# EAGLE board 7_7_9_usb_fpga (EAGLE 5.06)
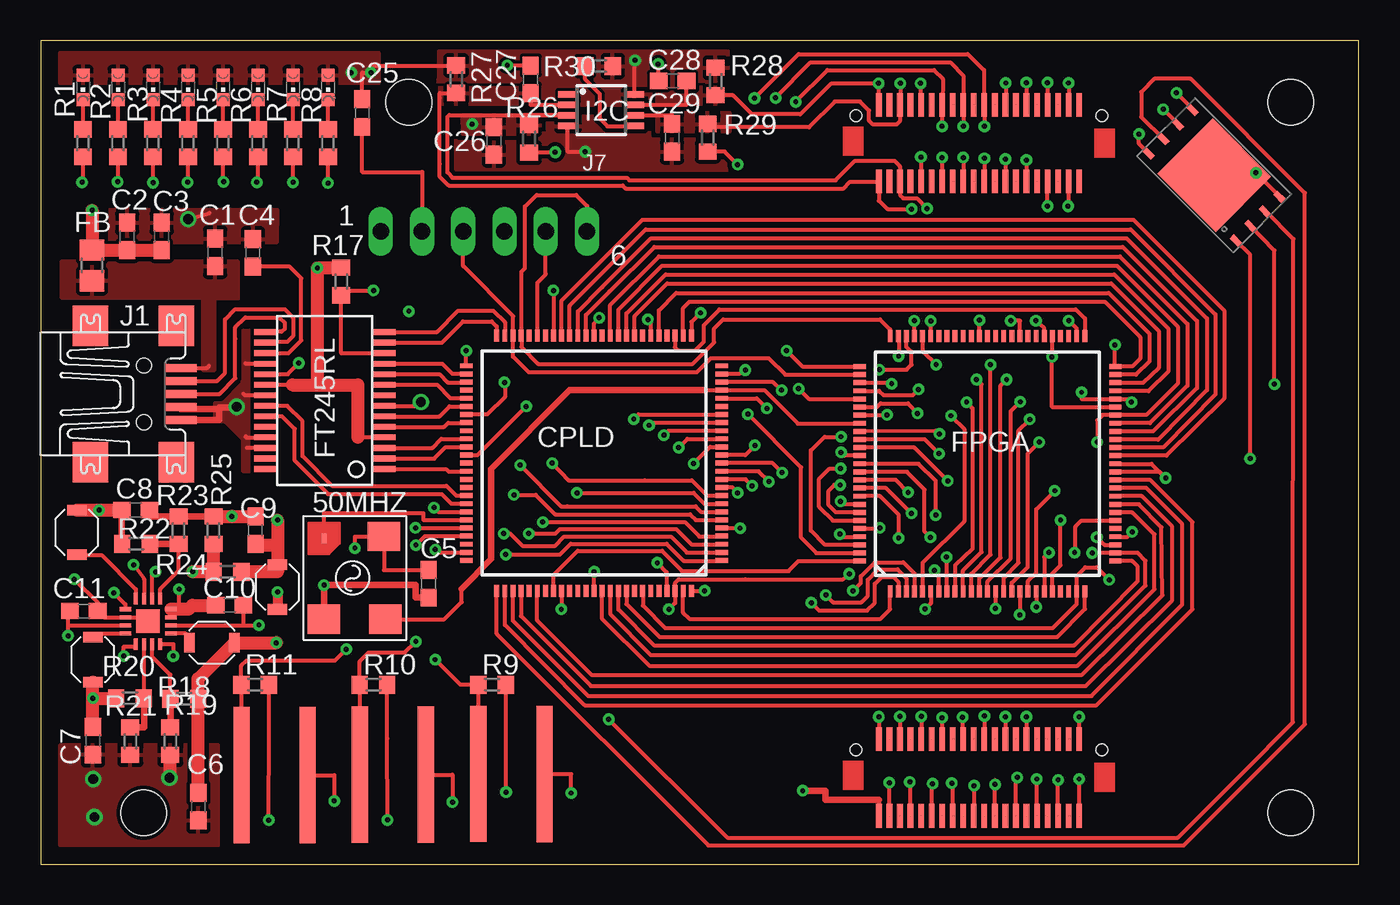
[diagram p2: board, top side]
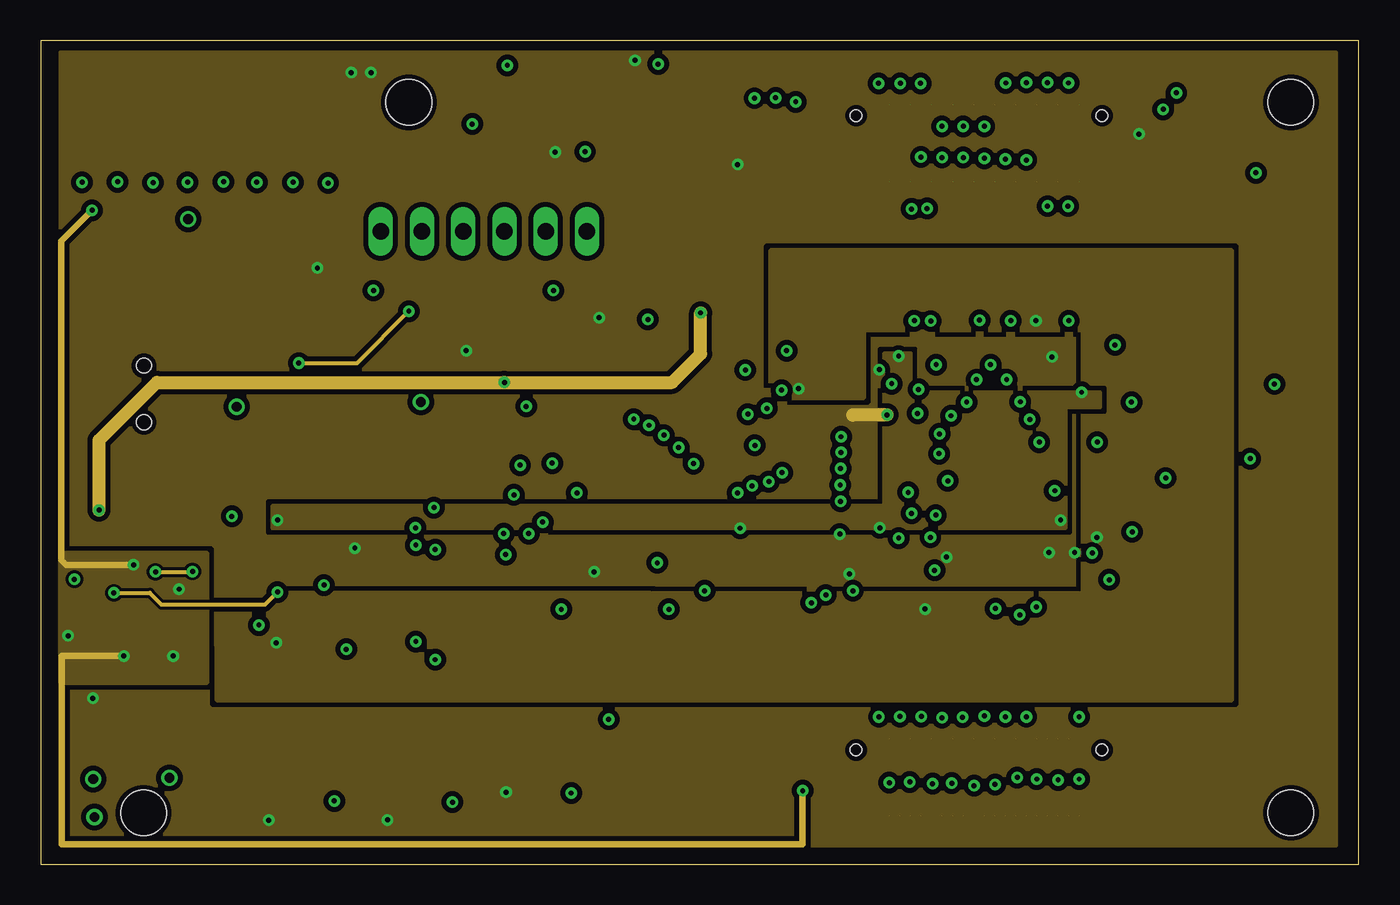
[diagram p3: board, inner layer Route2]
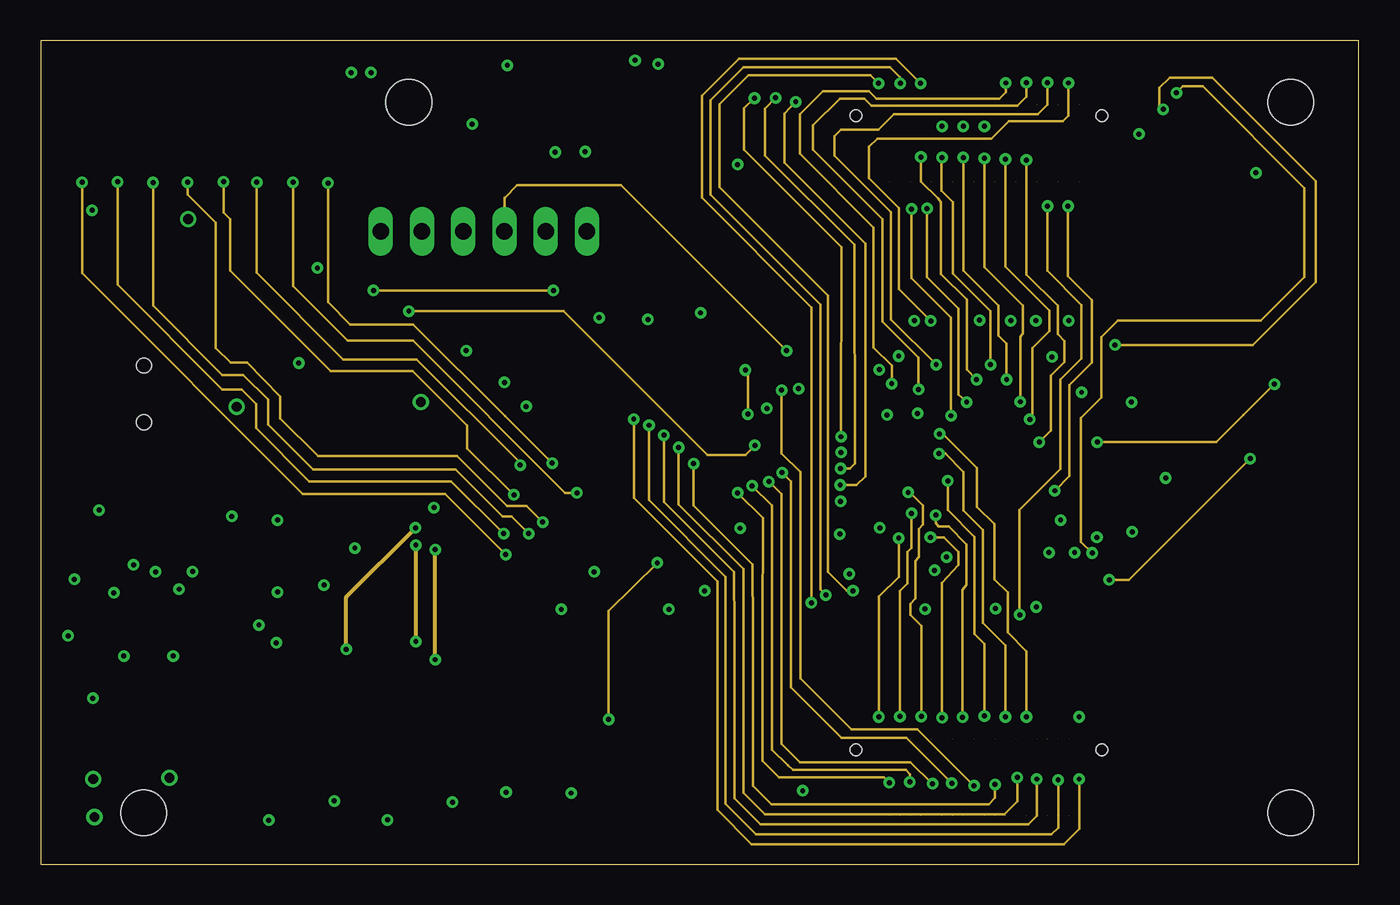
[diagram p4: board, inner layer Route15]
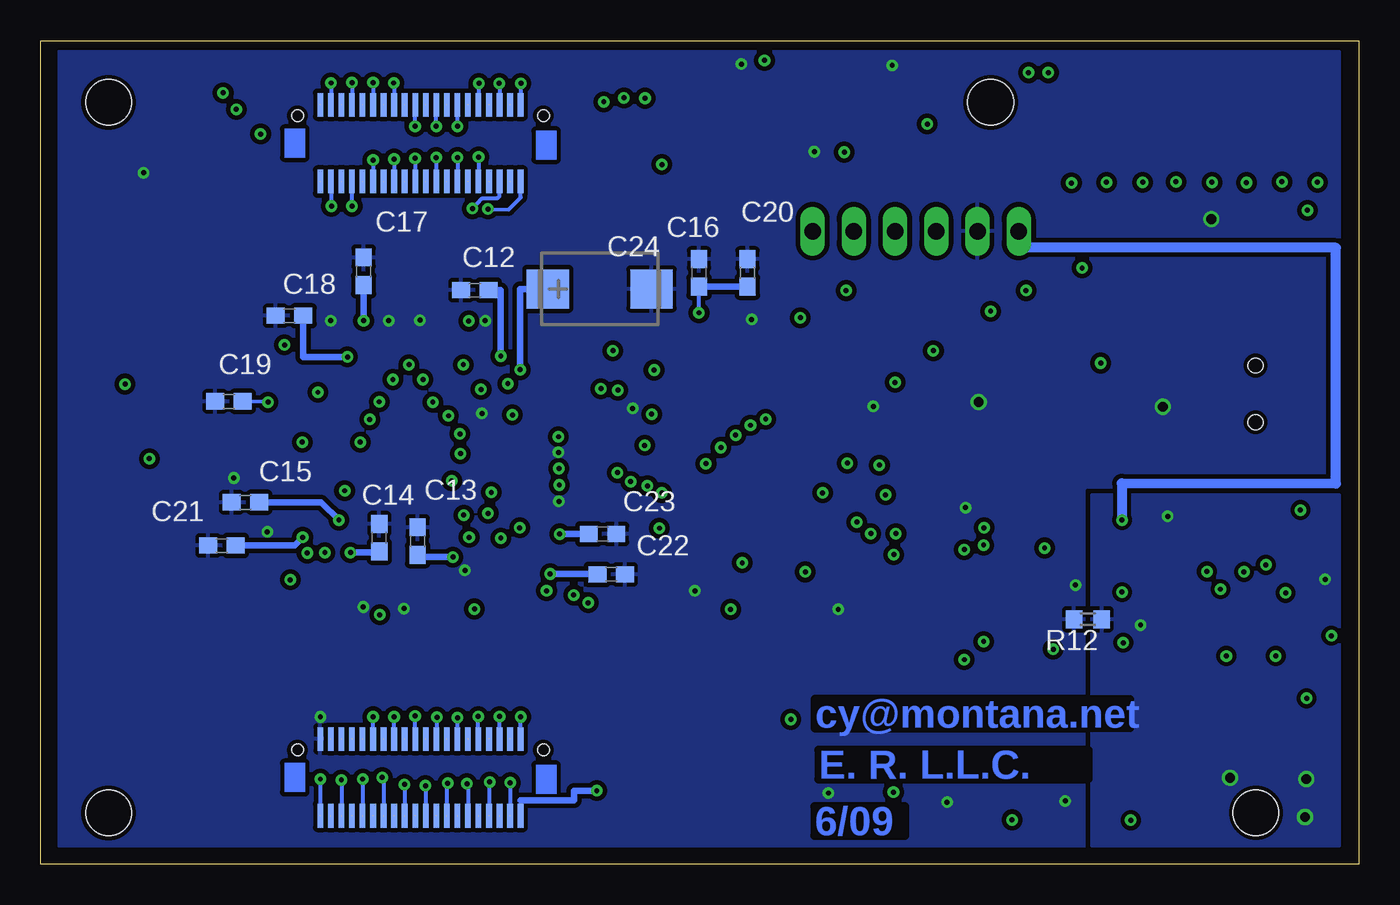
[diagram p5: board, bottom side, seen from below]

Size 81.29 x 50.8 mm. Coordinates in mm from the lower left corner, seen from the top.
Outline: 0,0 81.28,0 81.28,50.8 0,50.8 0,0
Copper layers (1*2+15*16): Top 0.055mm / dielectric 0.15mm / Route2 0.055mm / dielectric 0.15mm / Route15 0.055mm / dielectric 0.15mm / Bottom 0.055mm
Design rules "default *": minimum track width 5mil, minimum drill 12mil, track to track 7mil, track to pad 7mil, pad to pad 7mil, via to via 7mil, smd to smd 5mil, copper to edge 10mil, drill to drill 12mil, minimum pad ring 10mil, minimum via ring 8mil, stop-mask expansion 4mil, vias tented up to drill 0mil, thermal gap 10mil
Holes 2.8 mm at 77.09,46.99 77.09,3.17 22.71,46.99 6.35,3.17

## Footprints (pad centres in the part's own frame; a part is rotated, then mirrored left to right if it is on the bottom)
CB3 = smd 0.61 x 0.305: 1 -2.445,-1.905 | smd 1.803 x 2.007: 2 2.54,-1.905; 3 2.54,1.873; 4 -2.561,1.789
C0603 = smd 1.1 x 1: 1 -0.85,0; 2 0.85,0
CT7343 = smd 2.6 x 2.4: + -3.2,0; - 3.2,0
VQ100 = smd 0.75 x 0.3: 1 -7.875,6; 2 -7.875,5.5; 3 -7.875,5; 4 -7.875,4.5; 5 -7.875,4; 6 -7.875,3.5; 7 -7.875,3; 8 -7.875,2.5; 9 -7.875,2; 10 -7.875,1.5; 11 -7.875,1; 12 -7.875,0.5; 13 -7.875,0; 14 -7.875,-0.5; 15 -7.875,-1; 16 -7.875,-1.5; 17 -7.875,-2; 18 -7.875,-2.5; 19 -7.875,-3; 20 -7.875,-3.5; 21 -7.875,-4; 22 -7.875,-4.5; 23 -7.875,-5; 24 -7.875,-5.5; 25 -7.875,-6; 51 7.875,-6; 52 7.875,-5.5; 53 7.875,-5; 54 7.875,-4.5; 55 7.875,-4; 56 7.875,-3.5; 57 7.875,-3; 58 7.875,-2.5; 59 7.875,-2; 60 7.875,-1.5; 61 7.875,-1; 62 7.875,-0.5; 63 7.875,0; 64 7.875,0.5; 65 7.875,1; 66 7.875,1.5; 67 7.875,2; 68 7.875,2.5; 69 7.875,3; 70 7.875,3.5; 71 7.875,4; 72 7.875,4.5; 73 7.875,5; 74 7.875,5.5; 75 7.875,6 | smd 0.3 x 0.75: 26 -6,-7.875; 27 -5.5,-7.875; 28 -5,-7.875; 29 -4.5,-7.875; 30 -4,-7.875; 31 -3.5,-7.875; 32 -3,-7.875; 33 -2.5,-7.875; 34 -2,-7.875; 35 -1.5,-7.875; 36 -1,-7.875; 37 -0.5,-7.875; 38 0,-7.875; 39 0.5,-7.875; 40 1,-7.875; 41 1.5,-7.875; 42 2,-7.875; 43 2.5,-7.875; 44 3,-7.875; 45 3.5,-7.875; 46 4,-7.875; 47 4.5,-7.875; 48 5,-7.875; 49 5.5,-7.875; 50 6,-7.875; 76 6,7.875; 77 5.5,7.875; 78 5,7.875; 79 4.5,7.875; 80 4,7.875; 81 3.5,7.875; 82 3,7.875; 83 2.5,7.875; 84 2,7.875; 85 1.5,7.875; 86 1,7.875; 87 0.5,7.875; 88 0,7.875; 89 -0.5,7.875; 90 -1,7.875; 91 -1.5,7.875; 92 -2,7.875; 93 -2.5,7.875; 94 -3,7.875; 95 -3.5,7.875; 96 -4,7.875; 97 -4.5,7.875; 98 -5,7.875; 99 -5.5,7.875; 100 -6,7.875
R0805 = smd 1.3 x 1.5: 1 -0.95,0; 2 0.95,0
SSOP28DB = smd 0.348 x 1.397: 1 -4.225,-3.656; 2 -3.575,-3.656; 3 -2.925,-3.656; 4 -2.275,-3.656; 5 -1.625,-3.656; 6 -0.975,-3.656; 7 -0.325,-3.656; 8 0.325,-3.656; 9 0.975,-3.656; 10 1.625,-3.656; 11 2.275,-3.656; 12 2.925,-3.656; 13 3.575,-3.656; 14 4.225,-3.656; 15 4.225,3.656; 16 3.575,3.656; 17 2.925,3.656; 18 2.275,3.656; 19 1.625,3.656; 20 0.975,3.656; 21 0.325,3.656; 22 -0.325,3.656; 23 -0.975,3.656; 24 -1.625,3.656; 25 -2.275,3.656; 26 -2.925,3.656; 27 -3.575,3.656; 28 -4.225,3.656
MSOP8 = smd 0.4 x 1.2: 1 -0.975,-2.05; 2 -0.325,-2.05; 3 0.325,-2.05; 4 0.975,-2.05; 5 0.975,2.05; 6 0.325,2.05; 7 -0.325,2.05; 8 -0.975,2.05
UX60-MB-5ST = smd 2 x 0.5: 1 2.25,1.6; 2 2.25,0.8; 3 2.25,0; 4 2.25,-0.8; 5 2.25,-1.6 | smd 2.2 x 2.5: M1 -3.3,-4.2; M2 -3.3,4.2; M3 2,4.2; M4 2,-4.2 | hole 0.9: 0,-1.75; 0,1.75
DF15 = smd 1.45 x 0.35: P$1 -2.366,6.175; P$2 -2.366,5.525; P$3 -2.366,4.875; P$4 -2.366,4.225; P$5 -2.366,3.575; P$6 -2.366,2.925; P$7 -2.366,2.275; P$8 -2.366,1.625; P$9 -2.366,0.975; P$10 -2.366,0.325; P$11 -2.366,-0.325; P$12 -2.366,-0.975; P$13 -2.366,-1.625; P$14 -2.366,-2.275; P$15 -2.366,-2.925; P$16 -2.366,-3.575; P$17 -2.366,-4.225; P$18 -2.366,-4.875; P$19 -2.366,-5.525; P$20 -2.366,-6.175; P$21 2.366,-6.175; P$22 2.366,-5.525; P$23 2.366,-4.875; P$24 2.366,-4.225; P$25 2.366,-3.575; P$26 2.366,-2.925; P$27 2.366,-2.275; P$28 2.366,-1.625; P$29 2.366,-0.975; P$30 2.366,-0.325; P$31 2.366,0.325; P$32 2.366,0.975; P$33 2.366,1.625; P$34 2.366,2.275; P$35 2.366,2.925; P$36 2.366,3.575; P$37 2.366,4.225; P$38 2.366,4.875; P$39 2.366,5.525; P$40 2.366,6.175 | hole 0.7: 1.693,7.577; 1.69,-7.583
DF15_ = smd 1.45 x 0.35: P$1 -2.366,6.175; P$2 -2.366,5.525; P$3 -2.366,4.875; P$4 -2.366,4.225; P$5 -2.366,3.575; P$6 -2.366,2.925; P$7 -2.366,2.275; P$8 -2.366,1.625; P$9 -2.366,0.975; P$10 -2.366,0.325; P$11 -2.366,-0.325; P$12 -2.366,-0.975; P$13 -2.366,-1.625; P$14 -2.366,-2.275; P$15 -2.366,-2.925; P$16 -2.366,-3.575; P$17 -2.366,-4.225; P$18 -2.366,-4.875; P$19 -2.366,-5.525; P$20 -2.366,-6.175; P$21 2.366,-6.175; P$22 2.366,-5.525; P$23 2.366,-4.875; P$24 2.366,-4.225; P$25 2.366,-3.575; P$26 2.366,-2.925; P$27 2.366,-2.275; P$28 2.366,-1.625; P$29 2.366,-0.975; P$30 2.366,-0.325; P$31 2.366,0.325; P$32 2.366,0.975; P$33 2.366,1.625; P$34 2.366,2.275; P$35 2.366,2.925; P$36 2.366,3.575; P$37 2.366,4.225; P$38 2.366,4.875; P$39 2.366,5.525; P$40 2.366,6.175
6410-06 = drill 1.016 long: 1 6.35,0; 2 3.81,0; 3 1.27,0; 4 -1.27,0; 5 -3.81,0; 6 -6.35,0
L3010 = smd 0.65 x 1.2: P$1 -1.375,0; P$2 1.375,0
CHIPLED_0603 = smd 0.8 x 0.8: A 0,-0.75; C 0,0.75
R0603 = smd 1 x 1.1: 1 -0.85,0; 2 0.85,0
VDFPN8 = smd 0.762 x 0.356: 1 -3.81,1.905; 2 -3.81,0.635; 3 -3.81,-0.635; 4 -3.81,-1.905; 5 3.81,-1.905; 6 3.81,-0.635; 7 3.81,0.635; 8 3.81,1.905 | smd 5.08 x 4.826: NC 0,0
BS3N = smd 8.4 x 1: 1 -0.01,-2.035; 2 0,2.035
QFN16 = smd 0.7 x 0.25: 1 -1.4,0.75; 2 -1.4,0.25; 3 -1.4,-0.25; 4 -1.4,-0.75; 9 1.4,-0.75; 10 1.4,-0.25; 11 1.4,0.25; 12 1.4,0.75 | smd 0.25 x 0.7: 5 -0.75,-1.4; 6 -0.25,-1.4; 7 0.25,-1.4; 8 0.75,-1.4; 13 0.75,1.4; 14 0.25,1.4; 15 -0.25,1.4; 16 -0.75,1.4 | smd 1.45 x 1.45: P$17 0,0

## Placement (x,y rotation side)
50MHZ  CB3  [CB3]  19.38,17.65 270 top
C1  .01 UF  [C0603]  10.77,37.74 90 top
C2  4.7 UF  [C0603]  5.35,38.72 90 top
C3  .1 UF  [C0603]  7.47,38.72 90 top
C4  .1 UF  [C0603]  13.09,37.71 90 top
C5  .01 UF  [C0603]  23.93,17.3 90 top
C6  4.7 UF  [C0603]  9.73,3.56 270 top
C7  4.7 UF  [C0603]  3.23,7.62 270 top
C8  4.7 UF  [C0603]  5.87,21.84 0 top
C9  4.7 UF  [C0603]  13.26,20.6 90 top
C10  4.7 UF  [C0603]  11.66,15.98 0 top
C11  4.7 UF  [C0603]  2.67,15.62 180 top
C12  4.7 UF  [C0603]  54.51,35.41 180 bottom
C13  4.7 UF  [C0603]  58.04,19.94 90 bottom
C14  .47 UF  [C0603]  60.4,20.14 90 bottom
C15  .47 UF  [C0603]  68.66,22.33 180 bottom
C16  .47 UF  [C0603]  40.69,36.47 90 bottom
C17  .47 UF  [C0603]  61.37,36.58 90 bottom
C18  .047 UF  [C0603]  65.94,33.83 180 bottom
C19  .047 UF  [C0603]  69.67,28.55 180 bottom
C20  .047 UF  [C0603]  37.69,36.47 90 bottom
C21  .047 UF  [C0603]  70.1,19.66 180 bottom
C22  .047 UF  [C0603]  46.1,17.88 0 bottom
C23  .047 UF  [C0603]  46.63,20.37 0 bottom
C24  470 UF  [CT7343]  46.81,35.48 0 bottom
C25  50 PF  [C0603]  19.83,46.33 270 top
C26  50 PF  [C0603]  27.95,44.62 270 top
C27  50 PF  [C0603]  30.22,48.41 90 top
C28  50 PF  [C0603]  38.97,48.31 180 top
C29  50 PF  [C0603]  38.94,44.81 270 top
CPLD  XC2C64A_VQ100  [VQ100]  34.12,24.74 180 top
FB  1uH  [R0805]  3.17,36.93 90 top
FPGA  XC3S100E_VQ100  [VQ100]  58.38,24.7 90 top
FT245RL  FT245RL  [SSOP28DB]  17.53,28.6 90 top
I2C  LTC4300-1  [MSOP8]  34.57,46.51 270 top
J1  MINI-USB  [UX60-MB-5ST]  6.38,29.01 0 top
J3  DF15_40  [DF15]  57.86,5.36 90 top
J4  DF15_40_  [DF15_]  57.86,5.36 270 bottom
J5  DF15_40  [DF15]  57.86,44.48 90 top
J6  DF15_40_  [DF15_]  57.86,44.48 270 bottom
J7  22-27-2061-06  [6410-06]  27.33,39.04 180 top
L1  4.7 UH  [L3010]  10.57,13.67 0 top
L2  4.7 UH  [L3010]  14.61,17.09 270 top
L3  4.7 UH  [L3010]  2.24,20.47 270 top
L4  4.7 UH  [L3010]  3.23,12.62 270 top
LED1  [CHIPLED_0603]  2.62,47.9 180 top
LED2  [CHIPLED_0603]  4.78,47.9 180 top
LED3  [CHIPLED_0603]  6.93,47.9 180 top
LED4  [CHIPLED_0603]  9.09,47.9 180 top
LED5  [CHIPLED_0603]  11.25,47.9 180 top
LED6  [CHIPLED_0603]  13.41,47.9 180 top
LED7  [CHIPLED_0603]  15.57,47.9 180 top
LED8  [CHIPLED_0603]  17.73,47.9 180 top
R1  [R0603]  2.62,44.48 90 top
R2  [R0603]  4.78,44.48 90 top
R3  [R0603]  6.93,44.48 90 top
R4  [R0603]  9.09,44.48 90 top
R5  [R0603]  11.25,44.48 90 top
R6  [R0603]  13.41,44.48 90 top
R7  [R0603]  15.57,44.48 90 top
R8  [R0603]  17.73,44.48 90 top
R9  10k  [R0603]  27.84,11.07 0 top
R10  10k  [R0603]  20.52,11.07 0 top
R11  10k  [R0603]  13.23,11.07 0 top
R12  0  [R0603]  16.71,15.11 180 bottom
R17  10k  [R0603]  18.54,35.94 90 top
R18  500  [R0603]  8.86,10.21 0 top
R19  1k3  [R0603]  8,7.59 90 top
R20  3125  [R0603]  5.51,10.24 180 top
R21  1k3  [R0603]  5.54,7.59 90 top
R22  1250  [R0603]  5.89,19.76 180 top
R23  1k3  [R0603]  8.51,20.6 270 top
R24  2125  [R0603]  11.53,18.03 0 top
R25  1k3  [R0603]  10.67,20.6 270 top
R26  20 k  [R0603]  30.12,44.74 270 top
R27  20 k  [R0603]  25.62,48.41 90 top
R28  20 k  [R0603]  41.62,48.28 90 top
R29  20 k  [R0603]  41.14,44.81 270 top
R30  10 k  [R0603]  34.43,49.23 0 top
SPI_FLASH  M25P16  [VDFPN8]  72.36,42.5 135 top
SW1  BS3N  [BS3N]  29.03,5.57 270 top
SW2  BS3N  [BS3N]  21.72,5.53 270 top
SW3  BS3N  [BS3N]  14.43,5.5 270 top
VOLTAGE_REG  LTC3544  [QFN16]  6.63,14.99 270 top

## Tracks (layer width: path | path; a pad name or v marks a point on that pad's centre or on a via)
1.8V  (via drill 0.3, 0.3 pad 0.41)
  Top 0.254: CPLD.57 27.54,27.74 28.63,28.83 28.63,29.82 v28.6,29.72 | CPLD.26 40.12,33.45 v40.69,34.01
  Top 0.406: C8.1 5.02,19.76 R22.2
  Top 0.813: 5.02,19.76 R22.2 | 4.93,21.93 C8.1 v3.61,21.84 L3.P$1
  Route2 0.813: v40.69,34.01 40.69,31.47 38.94,29.72 v28.6,29.72 7.16,29.72 3.61,26.16 v3.61,21.84
  Bottom 0.254: v40.69,34.01 C16.1
  Bottom 0.406: C16.1 C20.1
_D1
  Top 0.254: FPGA.41 66.27,26.19 68.91,26.19 71.91,29.23 71.91,33.66 66.95,38.61 37.64,38.61 34.62,35.59 33.12,34.09 CPLD.40
_D2
  Top 0.254: FPGA.40 66.29,25.7 69.22,25.7 72.44,28.98 72.44,33.91 67.21,39.14 37.31,39.14 34.12,35.95 32.62,34.45 CPLD.41
_D3
  Top 0.254: CPLD.77 28.62,14.76 33.55,9.8 65.1,9.8 71.02,15.72 71.02,21.11 68.43,23.7 66.33,23.7 FPGA.36
_D4
  Top 0.254: CPLD.78 29.12,15.02 33.76,10.39 64.8,10.39 70.38,16.03 70.38,20.98 68.17,23.22 66.4,23.22 FPGA.35
_D5
  Top 0.254: CPLD.79 29.62,15.31 33.93,11 64.44,11 69.77,16.28 69.77,20.83 67.89,22.71 FPGA.34
_D6
  Top 0.254: CPLD.81 30.62,15.04 33.96,11.68 64.21,11.68 69.16,16.59 69.11,20.78 67.72,22.2 66.36,22.2 FPGA.33
_D7
  Top 0.254: CPLD.89 34.62,15.13 37.54,12.24 63.93,12.24 68.68,16.97 68.68,20.34 67.31,21.69 FPGA.32
AGND  (via drill 0.3, 0.6)
  Top 0.254: VOLTAGE_REG.14 11.35,14.74 12.55,14.74 | 12.55,14.74 13.44,14.74 v13.46,14.76 | C10.2 12.51,14.78 12.55,14.74 | v2.08,17.58 3.52,16.14 C11.1 3.9,15.24 VOLTAGE_REG.6 6.38,15.24 VOLTAGE_REG.P$17
  Top 0.406: C8.2 6.72,21.45 R23.1 R25.1
  Top 0.813: R25.1 11.77,21.45 v11.79,21.46 13.24,21.46 C9.2 | R19.1 7.95,6.62 v7.95,5.33
  other vias: 3.25,5.26 3.33,2.92
  pour Bottom (isolate 0.254): 1.22,1.17 1.22,22.76 16.46,22.76 16.46,1.17
  pour Top (isolate 0.254): 1.22,7.37 10.92,7.37 10.92,1.17 1.22,1.17
BUSY
  Top 0.254: CPLD.91 35.62,15.71 37.82,13.51 63.73,13.51 67.64,17.48 67.64,18.36 67.31,18.69 66.28,18.69 FPGA.26
CCLK  (via drill 0.3)
  Top 0.254: v66.24,32.03 66.24,30.71 FPGA.50 67.31,30.71 67.79,31.19 67.79,32.51 65.61,34.7 40.41,34.7 40.01,34.7 39.62,34.31 CPLD.27 | SPI_FLASH.6 69.98,45.79 v69.22,46.56
  Route15 0.152: v69.22,46.56 68.99,46.79 68.99,47.88 69.62,48.51 72.24,48.51 78.61,42.14 78.61,35.89 74.75,32.03 v66.24,32.03
CE
  Top 0.254: 50MHZ.1 17.48,21.67 23.6,21.67 23.6,21.24 CPLD.70
CSO_B  (via drill 0.3)
  Top 0.254: CPLD.94 37.13,16.86 37.13,15.95 38.51,14.58 62.41,14.58 63.88,16.05 FPGA.24 63.88,17.78 64.41,18.31 65.13,18.31 v65.89,17.55 | SPI_FLASH.1 74.57,37.59 v74.57,25.02
  Route15 0.152: v74.57,25.02 67.11,17.55 v65.89,17.55
D0
  Top 0.254: FT245RL.1 24.99,24.38 25.13,24.23 CPLD.64
D1
  Top 0.254: FT245RL.5 24.88,26.98 25.13,27.23 26.21,27.23 CPLD.58
D2
  Top 0.254: FT245RL.3 24.16,25.68 24.7,26.24 CPLD.60
D3
  Top 0.254: FT245RL.11 24.76,30.88 25.39,30.25 26.24,30.25 CPLD.52
D4
  Top 0.254: FT245RL.2 24.28,25.02 24.98,25.73 26.21,25.73 CPLD.61
D5
  Top 0.254: FT245RL.9 24.44,29.57 25.26,28.75 26.24,28.75 CPLD.55
D6
  Top 0.254: FT245RL.10 24.6,30.23 25.11,29.72 26.27,29.72 CPLD.53
D7
  Top 0.254: FT245RL.6 24.59,27.62 25.21,28.25 CPLD.56
DGND  (via drill 0.3, 0.3 pad 0.41, 0.6)
  Top 0.254: v9.11,39.79 10.41,40.16 | FT245RL.7 23.18,28.27 v23.44,28.51 | FT245RL.26 12.73,25.68 12.72,25.68 | FT245RL.21 12.6,28.93 12.52,29.01 | FT245RL.18 12.66,30.88 12.62,30.91 | FPGA.19 61.39,16.82 v61.39,15.88 | FPGA.14 v58.88,15.77 | FPGA.37 68.99,24.2 v69.37,23.82 68.49,24.7 FPGA.38 | FPGA.52 63.88,33.04 v63.4,33.53 | FPGA.64 v57.88,33.55 v57.89,33.55 | FPGA.72 53.88,33.52 v53.87,33.53 | FPGA.87 49.56,25.2 v49.35,25.4 | CPLD.21 44.16,28.74 v44.78,28.12 | CPLD.84 32.12,15.74 v32.11,15.72 | CPLD.100 41.07,16.86 v40.95,16.87 | CPLD.69 24.51,21.74 v24.26,22 | FPGA.29 67.01,20.2 v67.31,20.5 | CPLD.31 37.62,33.37 arc90 v37.44,33.6 | CPLD.62 26.94,25.24 v29.95,28.25 | FPGA.59 60.38,33.53 v59.82,33.53 | FPGA.7 55.38,17.85 v55.12,18.14 | SPI_FLASH.4 76.43,41.15 v74.93,42.65 | FPGA.81 51.57,28.2 51.79,28.42 53.49,28.42 v54.08,27.81 | FPGA.93 49.45,22.2 v49.33,22.38 | 32.51,45.55 32.51,43.95 v33.57,43.95 | FT245RL.25 12.65,26.32 12.65,26.39 | C28.2 38.08,48.31 v38.08,49.35 | C27.2 28.78,49.26 v28.78,49.28 | C25.2 19.83,42.7 23.55,42.7 23.52,42.7 J7.2 | SW3.2 18.11,5.5 v18.11,3.91 | SW2.2 25.4,5.53 v25.4,3.83 | SW1.2 32.72,5.57 v32.72,4.39 | J4.P$20 v64.03,9.09
  Top 0.406: 50MHZ.2 v17.48,17.22 23.11,17.22 23.11,16.46 C5.1 | J1.5 11.02,27.41 11.02,28.09 | 11.02,28.09 11.02,28.17 12.09,28.17 v12.09,28.22 | J1.4 8.62,28.09 11.02,28.09
  Top 0.813: C5.1
  pour Bottom (isolate 0.279, rank 2): 1.22,1.17 1.22,50.09 80.14,50.09 80.14,1.17
  pour Top: 4.32,40.37 14.58,40.37 14.55,38.35 4.29,38.35
  pour Top (isolate 0.254): 10.77,28.45 11.25,28.45 12.47,29.67 12.47,31.24 12.5,32.92 12.88,32.92 12.9,24.23 12.5,24.23 12.5,26.19 11.38,27.3 10.77,27.3
  pour Top (isolate 0.254, rank 2): 24.83,46.17 42.54,46.14 42.54,42.79 24.84,42.8 24.83,43.18 24.84,45.22
DIN/_D0  (via drill 0.3)
  Top 0.254: CPLD.35 35.62,34.2 38.33,36.91 66.37,36.91 70.1,33.17 70.1,29.64 68.17,27.71 FPGA.44 66.25,27.71 65.48,27.71 65.15,27.38 v65.15,26.04 | SPI_FLASH.2 76.07,37.86 v76.07,29.62
  Route15 0.152: v76.07,29.62 74.17,27.71 72.49,26.04 v65.15,26.04
DONE
  Top 0.254: FPGA.51 64.39,33.66 63.83,34.21 41.86,34.21 40.89,33.25 40.89,32.23 40.34,31.67 39.32,31.67 39.12,31.88 CPLD.28
FPGA_TDI
  Top 0.254: FPGA.100 46.72,18.7 46.13,18.09 39.55,18.09 38.33,19.33 33.12,19.33 31.62,17.83 CPLD.83
HOLD
  Top 0.254: SPI_FLASH.7 67.87,46.09 67.87,47.62 68.66,48.44 70.92,48.44 77.95,41.4 77.95,8.64 70.48,1.17 41.17,1.17 28.12,14.22 CPLD.76
HSWAP  (via drill 0.3 pad 0.41)
  Top 0.254: FPGA.99 47.83,19.2 46.89,20.14 46.89,24.49 v43.61,27.76 | v43.46,30.48 43.07,30.24 CPLD.24
  Route15 0.152: v43.61,27.76 43.61,30.43 v43.46,30.48
INIT_B
  Top 0.254: CPLD.92 36.12,16.05 38.18,14.02 62.69,14.02 64.39,15.75 64.39,16.74 FPGA.25
J3_2  (via drill 0.3 pad 0.41)  (1 unrouted)
  Top 0.254: CPLD.10 42.65,23.24 v42.98,22.91 | J4.P$39 52.34,5.04 52.32,5.05
  Route15 0.152: v42.98,22.91 44.53,21.36 44.5,14.45 44.5,6.38 45.52,5.36 51.99,5.36 v52.32,5.03
  Bottom 0.254: J4.P$39 52.34,5.02 v52.32,5.03
J3_3  (1 unrouted)
J3_4  (via drill 0.3 pad 0.41)  (1 unrouted)
  Top 0.254: CPLD.11 43.47,23.74 v43.87,23.34 | J4.P$37 53.64,5.01 53.59,5.05
  Route15 0.152: v43.87,23.34 45.09,22.12 45.11,14.45 45.11,7.06 46.08,6.1 46.38,5.82 53.34,5.82 53.59,5.56 v53.59,5.08
  Bottom 0.254: J4.P$37 53.64,5.04 v53.59,5.08
J3_5  (1 unrouted)
J3_6  (via drill 0.3 pad 0.41)
  Top 0.254: CPLD.12 44.26,24.24 v44.91,23.6 | J4.P$35 54.94,4.97 v54.99,4.98
  Route15 0.152: v44.91,23.6 45.67,22.84 45.67,14.48 45.67,7.42 46.81,6.3 53.65,6.3 v54.99,4.98
  Bottom 0.254: J4.P$35 54.94,4.97 v54.99,4.98
J3_7  (1 unrouted)
J3_8  (via drill 0.3 pad 0.41)  (1 unrouted)
  Top 0.254: CPLD.13 45.14,24.74 v45.72,24.16 | J4.P$33 56.24,4.98 | 56.24,4.98
  Route15 0.152: v45.72,24.16 46.25,23.6 46.25,14.43 46.25,10.92 49.38,7.8 53.39,7.8 v56.19,5
  Bottom 0.254: J4.P$33 56.24,4.95 v56.19,5
J3_9  (1 unrouted)
J3_10  (via drill 0.3 pad 0.41)
  Top 0.254: CPLD.23 45.16,29.74 v45.7,29.23 | v57.56,4.85 57.56,3.01 J4.P$31
  Route15 0.152: v57.56,4.85 54.08,8.33 49.99,8.33 46.84,11.48 46.84,14.43 46.84,24.18 45.7,25.32 v45.7,29.23
  Bottom 0.254: J4.P$31 57.54,4.83 v57.56,4.85
J3_11  (1 unrouted)
J3_12  (via drill 0.3 pad 0.41)  (1 unrouted)
  Top 0.254: CPLD.15 41.28,25.74 v40.26,24.71 | J4.P$29 58.84,3.39 58.85,5.21
  Route15 0.152: v40.26,24.71 40.26,22.12 43.89,18.49 43.92,14.5 43.92,4.85 45.06,3.71 58.47,3.71 58.85,4.12 v58.85,4.93
  Bottom 0.254: J4.P$29 58.84,5.17 v58.85,4.93
J3_13  (1 unrouted)
J3_14  (via drill 0.3 pad 0.41)  (1 unrouted)
  Top 0.254: CPLD.16 39.88,26.24 v39.34,25.7 | J4.P$27 60.14,5.27 60.2,5.33
  Route15 0.152: v39.34,25.7 39.34,22.2 43.33,18.21 43.33,14.5 43.33,4.42 44.65,3.1 59.44,3.1 60.22,3.89 v60.22,5.36
  Bottom 0.254: 60.22,3.08 J4.P$27 60.14,5.27 v60.22,5.36
J3_15  (1 unrouted)
J3_16  (via drill 0.3 pad 0.41)  (1 unrouted)
  Top 0.254: CPLD.17 38.7,26.74 v38.43,26.47 | J4.P$25 61.44,5.23
  Route15 0.152: v38.43,26.47 38.43,22.35 42.75,18.03 42.77,14.45 42.77,4.06 44.37,2.46 60.91,2.46 J4.P$25 61.44,5.24 v61.42,5.26
  Bottom 0.254: J4.P$25 61.44,5.24 v61.42,5.26
J3_17  (1 unrouted)
J3_18  (via drill 0.3 pad 0.41)  (1 unrouted)
  Top 0.254: CPLD.18 37.68,27.24 v37.52,27.08 | J4.P$23 62.74,5.18 62.76,5.21
  Route15 0.152: v37.52,27.08 37.52,22.45 42.24,17.73 42.22,14.48 42.22,3.73 44.09,1.85 62.33,1.85 62.74,2.26 62.74,5 v62.74,5.21
  Bottom 0.254: J4.P$23 v62.74,5.21
J3_19  (1 unrouted)
J3_20  (via drill 0.3 pad 0.41)  (1 unrouted)
  Top 0.254: CPLD.19 36.86,27.74 v36.58,27.46 | J4.P$21 64.04,5.23 64.03,5.23
  Route15 0.152: v36.58,27.46 36.58,22.61 41.73,17.45 41.73,14.45 41.73,3.35 43.84,1.25 63.09,1.25 64.03,2.18 64.03,5.16 v64.03,5.26
  Bottom 0.254: J4.P$21 v64.04,5.25 v64.03,5.26
J3_22  (1 unrouted)
J3_23  (1 unrouted)
J3_24  (1 unrouted)
J3_25  (1 unrouted)
J3_26  (via drill 0.3 pad 0.41)
  Top 0.254: FPGA.84 55.2,26.73 v55.42,26.54 | v60.78,9.09 J4.P$15
  Route15 0.152: v60.78,9.09 60.78,13.13 59.64,14.3 59.64,16.76 58.8,17.58 58.8,20.98 57.73,22.05 57.73,24.43 55.63,26.54 v55.42,26.54
  Bottom 0.254: J4.P$15 v60.78,9.09
J3_27  (1 unrouted)
J3_28  (via drill 0.3 pad 0.41)
  Top 0.254: FPGA.85 54.52,26.2 v55.4,25.32 | v59.49,9.09 J4.P$13
  Route15 0.152: v55.4,25.32 55.78,25.32 56.9,24.21 56.9,21.82 58.12,20.62 58.12,14.88 59.49,13.49 v59.49,9.09
  Bottom 0.254: J4.P$13 v59.49,9.09
J3_29  (1 unrouted)
J3_30  (via drill 0.3 pad 0.41)
  Top 0.254: FPGA.86 53.88,25.7 v55.93,23.65 | v58.19,9.14 J4.P$11
  Route15 0.152: v55.93,23.65 55.93,21.84 57.58,20.19 57.58,14.2 58.19,13.59 v58.19,9.14
  Bottom 0.254: J4.P$11 v58.19,9.14
J3_31  (1 unrouted)
J3_32  (via drill 0.3 pad 0.41)
  Top 0.254: FPGA.88 54.14,24.7 55.19,23.65 v55.19,21.54 | v56.84,9.07 56.84,7.77 J4.P$9
  Route15 0.152: v55.19,21.54 55.19,21.06 55.37,20.83 56.01,20.83 57.07,19.74 57.07,17.22 56.84,16.92 v56.84,9.07
  Bottom 0.254: J4.P$9 56.84,7.77 v56.84,9.07
J3_33  (1 unrouted)
J3_34  (via drill 0.3 pad 0.41)
  Top 0.254: FPGA.89 53.42,24.2 54.51,23.11 54.51,20.52 v54.86,20.17 | v55.58,9.04 55.58,7.74 J4.P$7
  Route15 0.152: v54.86,20.17 55.7,20.17 56.59,19.28 56.59,18.47 55.58,17.35 v55.58,9.04
  Bottom 0.254: J4.P$7 55.58,7.74 v55.58,9.04
J3_35  (1 unrouted)
J3_36  (via drill 0.3 pad 0.41)
  Top 0.254: FPGA.90 52.73,23.7 v53.49,22.94 | v54.3,9.12 54.3,7.74 J4.P$5
  Route15 0.152: v53.49,22.94 53.59,22.94 54.41,22.12 54.41,20.95 54.15,20.68 54.15,18.95 53.95,18.72 53.95,16.38 53.62,16.05 53.62,15.39 54.3,14.71 v54.3,9.12
  Bottom 0.254: J4.P$5 54.3,7.74 v54.3,9.12
J3_37  (1 unrouted)
J3_38  (via drill 0.3 pad 0.41)
  Top 0.254: FPGA.91 52.13,23.2 v53.7,21.64 | v52.98,9.12 J4.P$3
  Route15 0.152: v53.7,21.64 53.7,19.51 53.44,19.25 53.44,17.32 52.98,16.87 v52.98,9.12
  Bottom 0.254: J4.P$3 v52.98,9.12
J3_39  (1 unrouted)
J3_40  (via drill 0.3 pad 0.41)
  Top 0.254: FPGA.92 51.75,22.7 52.91,21.54 v52.91,20.12 | v51.69,9.09 J4.P$1
  Route15 0.152: v52.91,20.12 52.91,17.73 51.69,16.51 v51.69,9.09
  Bottom 0.254: J4.P$1 v51.69,9.09
J5_1  (via drill 0.3 pad 0.41)
  Top 0.254: FPGA.5 54.38,18.59 56.95,21.16 56.95,26.85 v56.13,27.66 | v53.7,40.41 52.22,40.41 51.69,40.92 J6.P$40 51.66,42.09 49.91,42.09 49.51,41.68 36.07,41.68 35.89,41.86 25.17,41.86 24.61,42.39 24.61,43.18 24.61,47.26 24.61,47.56 R27.1 | I2C.2 30.22,46.83 C27.1
  Route15 0.152: v56.13,27.66 56.13,33.71 53.7,36.14 v53.7,40.41
  Bottom 0.254: J6.P$40 arc-90 J6.P$40 51.69,41.12 52.43,40.39 v53.7,40.41
  pour Top (isolate 0.127, rank 2): 24.63,47.9 30.21,47.92 30.21,46.87 24.63,46.86
J5_2  (1 unrouted)
J5_3  (via drill 0.3 pad 0.41)
  Top 0.254: FPGA.9 56.38,18.43 57.45,19.46 57.45,28.12 v57.1,28.5 | v54.66,40.44 54.03,41.07 53.19,41.07 52.99,41.27 J6.P$38 52.98,43.05 52.65,43.38 50.22,43.38 49.02,42.19 36.3,42.19 36.14,42.34 25.4,42.34 25.09,42.67 25.09,46.1 25.2,46.21 I2C.3 29.76,46.18 29.76,46.2 R26.1
  Route15 0.152: v57.1,28.5 56.59,28.98 56.59,34.27 54.66,36.22 v54.66,40.44
  Bottom 0.254: J6.P$38 52.99,41.27 arc90 53.21,41.07 54.05,41.07 v54.66,40.44
  other vias: 26.61,45.65
  pour Top: 26.03,46.22 30.77,46.22 30.78,45.03 26.05,45.03
J5_4  (1 unrouted)
J5_5  (via drill 0.3 pad 0.41)
  Top 0.254: FPGA.10 56.88,18.12 58.01,19.25 58.01,29.59 v57.71,29.9 | v54.28,43.61 J6.P$36
  Route15 0.152: v57.71,29.9 57.1,30.5 57.1,34.82 55.52,36.4 55.52,40.84 55.32,41.07 J6.P$36 v54.29,43.6 v54.28,43.61
  Bottom 0.254: J6.P$36 v54.29,43.6 v54.28,43.61
J5_6  (1 unrouted)
J5_7  (via drill 0.3 pad 0.41)
  Top 0.254: FPGA.11 57.38,17.91 58.57,19.1 58.57,30.63 v58.57,30.81 | v55.58,43.59 55.58,42.12 J6.P$34
  Route15 0.152: v58.57,30.81 58.57,34.11 56.26,36.42 56.26,40.84 55.55,41.55 55.55,43.56 v55.58,43.59
  Bottom 0.254: J6.P$34 55.59,43.58 v55.58,43.59
J5_8  (1 unrouted)
J5_9  (via drill 0.3 pad 0.41)
  Top 0.254: FPGA.12 57.88,17.62 59.18,18.92 59.18,29.52 v59.56,29.9 | v56.9,43.59 J6.P$32
  Route15 0.152: v59.56,29.9 59.56,32.11 59.05,32.61 59.05,34.47 56.9,36.63 v56.9,43.59
  Bottom 0.254: J6.P$32 56.89,43.58 v56.9,43.59
J5_10  (1 unrouted)
J5_11  (via drill 0.3 pad 0.41)
  Top 0.254: FPGA.13 58.38,17.44 59.82,18.87 59.82,27.94 v60.4,28.52 | v58.19,43.54 J6.P$30
  Route15 0.152: v60.4,28.52 60.4,32.54 60.58,32.74 60.58,34.44 58.19,36.83 v58.19,43.54
  Bottom 0.254: J6.P$30 v58.19,43.53 v58.19,43.54
J5_12  (1 unrouted)
J5_13  (via drill 0.3 pad 0.41)
  Top 0.254: FPGA.15 59.38,17.68 60.3,18.59 60.3,26.75 v60.98,27.43 | v59.49,43.48 J6.P$28
  Route15 0.152: v60.98,27.43 61.14,27.58 61.14,31.83 62.2,32.89 62.2,34.14 59.49,36.85 v59.49,43.48
  Bottom 0.254: J6.P$28 v59.49,43.48
J5_14  (1 unrouted)
J5_15  (via drill 0.3 pad 0.41)
  Top 0.254: FPGA.16 59.88,17.36 60.86,18.34 60.86,25.32 v61.57,26.04 | v60.78,43.43 v60.79,43.43 J6.P$26
  Route15 0.152: v61.57,26.04 62.28,26.75 62.28,30.15 63.12,30.99 63.12,32.28 62.71,32.69 62.71,34.44 60.78,36.37 v60.78,43.43
  Bottom 0.254: J6.P$26 v60.78,43.43
J5_16  (1 unrouted)
J5_17  (via drill 0.3 pad 0.41)
  Top 0.254: FPGA.17 v60.38,15.39 | v62.08,40.59 v62.09,40.6 J6.P$24
  Route15 0.152: v60.38,15.39 60.35,15.42 60.35,21.84 62.89,24.38 62.89,29.9 64.19,31.19 64.19,34.49 62.08,36.6 v62.08,40.59
  Bottom 0.254: J6.P$24 62.08,42.1 v62.08,40.59
J5_18  (1 unrouted)
J5_19  (via drill 0.3 pad 0.41)
  Top 0.254: FPGA.18 60.88,17.47 61.39,17.98 61.39,21.89 v62.53,23.04 | v63.35,40.59 63.39,40.63 J6.P$22
  Route15 0.152: v62.53,23.04 63.42,23.95 63.42,29.57 64.82,30.94 64.82,34.8 63.35,36.27 v63.35,40.59
  Bottom 0.254: J6.P$22 63.35,42.07 v63.35,40.59
J5_20  (1 unrouted)
J5_21  (1 unrouted)
J5_22  (via drill 0.3 pad 0.41)
  Top 0.254: FPGA.70 v54.88,33.49 v54.89,33.5 | v63.37,48.18 63.39,48.17 J6.P$19
  Route15 0.152: v54.89,33.5 52.93,35.46 52.93,40.46 51.08,42.32 51.08,44.25 51.59,44.76 58.62,44.76 59.69,45.82 63.04,45.82 63.37,46.15 v63.37,48.18
  Bottom 0.254: J6.P$19 63.37,46.85 v63.37,48.18
J5_23  (1 unrouted)
J5_24  (via drill 0.3 pad 0.41)
  Top 0.254: FPGA.71 54.38,31.65 v55.22,30.81 | v62.08,48.21 62.08,46.85 J6.P$17
  Route15 0.152: v55.22,30.81 52.43,33.6 52.43,40.23 48.95,43.71 48.95,44.91 49.35,45.31 51.41,45.31 51.66,45.31 52.6,46.25 61.5,46.25 J6.P$17 v62.09,48.2 v62.08,48.21
  Bottom 0.254: J6.P$17 v62.09,48.2 v62.08,48.21
J5_25  (1 unrouted)
J5_26  (via drill 0.3 pad 0.41)
  Top 0.254: FPGA.79 51.7,29.2 51.97,28.93 53.77,28.93 v54.13,29.29 | J6.P$15 60.81,46.86 60.81,47.32 60.79,47.35 v60.79,48.2 v60.78,48.21
  Route15 0.152: v54.13,29.29 54.13,31.24 51.89,33.48 51.89,39.8 47.62,44.07 47.62,45.57 49.28,47.22 50.8,47.22 51.23,46.79 60.23,46.79 60.79,47.35 v60.79,48.2 v60.78,48.21
  Bottom 0.254: v60.78,48.21 J6.P$15
J5_27  (1 unrouted)
J5_28  (via drill 0.3 pad 0.41)
  Top 0.254: FPGA.78 52.42,29.7 v52.48,29.64 | v59.51,48.18 59.51,46.87 J6.P$13
  Route15 0.152: v52.48,29.64 52.48,30.76 51.36,31.88 51.36,39.27 46.81,43.81 46.81,46.25 48.23,47.68 51.08,47.68 51.54,47.22 59.13,47.22 59.51,47.6 v59.51,48.18
  Bottom 0.254: J6.P$13 59.49,48.23 v59.51,48.18
J5_29  (1 unrouted)
J5_30  (via drill 0.3, 0.3 pad 0.41)
  Top 0.254: FPGA.98 48.37,19.7 47.5,20.57 47.5,25.53 48.34,26.36 v49.35,26.36 | v44.02,47.24 46.74,49.96 57.17,49.96 58.17,48.97 58.17,46.86 J6.P$11 v58.19,45.52
  Route15 0.152: v49.35,26.36 49.38,38.08 43.38,44.07 43.36,46.63 v44.02,47.24
  Bottom 0.254: J6.P$11 58.19,45.47 v58.19,45.52
J5_31  (1 unrouted)
J5_32  (via drill 0.3, 0.3 pad 0.41)
  Top 0.254: FPGA.95 48.85,21.2 48.01,22.05 48.01,23.77 48.64,24.41 49.28,24.41 v49.33,24.41 | v45.31,47.27 47.47,49.45 56.08,49.45 56.9,48.64 J6.P$9 56.89,45.6 v56.9,45.52
  Route15 0.152: v49.33,24.41 49.91,24.41 50.22,24.71 50.19,38.23 44.68,43.71 44.68,46.61 v45.31,47.27
  Bottom 0.254: v56.9,45.52 J6.P$9
J5_33  (1 unrouted)
J5_34  (via drill 0.3, 0.3 pad 0.41)
  Top 0.254: FPGA.94 49.04,21.7 48.59,22.15 48.59,23.04 48.95,23.39 v49.3,23.39 | v46.56,47.02 48.51,48.97 55.09,48.97 55.63,48.44 55.6,46.86 J6.P$7 55.58,46.83 v55.58,45.52
  Route15 0.152: v49.3,23.39 50.32,23.39 50.85,23.93 50.85,38.28 45.87,43.26 45.87,46.28 v46.56,47.02
  Bottom 0.254: J6.P$7 v55.59,45.53 v55.58,45.52
J5_35  (1 unrouted)
J5_36  (via drill 0.3 pad 0.41)
  Top 0.254: FPGA.2 52.88,17.43 52.58,17.73 51.87,17.73 51.44,17.3 51.44,16.13 50.95,15.65 48.01,15.65 v47.52,16.13 | v54.25,48.16 54.25,46.87 J6.P$5
  Route15 0.152: v47.52,16.13 47.52,34.34 40.77,41.1 40.77,47.4 43.05,49.68 52.27,49.68 52.73,49.68 v54.25,48.16
  Bottom 0.254: J6.P$5 54.29,48.13 v54.25,48.16
J5_37  (1 unrouted)
J5_38  (via drill 0.3 pad 0.41)
  Top 0.254: FPGA.3 53.38,17.64 52.83,18.19 51.64,18.19 51,17.55 51,16.56 50.6,16.15 48.87,16.15 v48.41,16.61 | v53.01,48.16 52.99,47.04 J6.P$3 52.98,45.82 52.78,45.62 51.33,45.62 51.08,45.87 51.08,46.48 50.52,47.04 48.97,47.04 47.39,45.46 40.78,45.46 R29.1 | C29.1 38.94,46.18 I2C.6
  Route15 0.152: v48.41,16.61 48.08,16.94 48.08,34.52 41.3,41.3 41.3,47.12 43.33,49.15 52.38,49.15 52.98,48.54 v53.01,48.16
  Bottom 0.254: J6.P$3 52.99,48.13 v53.01,48.16
  pour Top: 38.05,46.35 42.48,46.35 42.48,45.18 38.05,45.15
J5_39  (1 unrouted)
J5_40  (via drill 0.3 pad 0.41)
  Top 0.254: FPGA.4 53.88,17.92 53.19,18.62 51.44,18.62 50.57,17.75 50.57,17.35 v50.09,16.87 | J6.P$1 51.63,48.16 v51.66,48.16 51.64,48.13 48.72,48.13 46.84,46.25 43.87,46.25 42.69,47.43 R28.1 | I2C.7 38.94,46.83 39.82,46.83 C28.1
  Route15 0.152: v51.66,48.16 51.18,48.67 43.64,48.67 41.86,46.89 41.86,41.76 48.54,35.08 48.54,18.03 49.71,16.87 v50.09,16.87
  Bottom 0.254: J6.P$1 51.69,48.14 v51.66,48.16
  pour Top (isolate 0.127, rank 2): 38.05,47.92 42.41,47.92 42.41,46.87 38.05,46.87
LED1  (via drill 0.3)
  Top 0.254: R1.1 2.62,42.11 v2.56,42.06 | v28.68,19.1 32.03,19.1 32.69,19.76 38.61,19.76 39.65,18.72 42.02,18.72 CPLD.1
  Route15 0.152: v2.56,42.06 2.56,36.45 16.15,22.84 24.94,22.84 v28.68,19.1
LED2  (via drill 0.3)
  Top 0.254: R2.1 4.78,42.11 v4.75,42.09 | v28.55,20.4 28.96,20.4 29.72,19.63 31.73,19.63 32.28,20.22 38.86,20.22 39.85,19.23 41.99,19.23 CPLD.2
  Route15 0.152: v4.75,42.09 4.75,37.11 4.75,35.74 11.2,29.29 12.39,29.29 13.28,28.4 13.28,26.9 16.56,23.62 25.32,23.62 v28.55,20.4
LED3  (via drill 0.3)
  Top 0.254: v6.93,42.04 R3.1 | v30.1,20.4 31.75,20.4 32.03,20.68 39.19,20.68 40.13,19.74 41.98,19.74 CPLD.3
  Route15 0.152: v6.93,42.04 6.93,35.99 6.93,34.47 11.2,30.18 12.5,30.18 14.02,28.65 14.02,27.13 16.82,24.33 25.58,24.33 28.47,21.46 29.03,21.46 v30.1,20.4
LED4  (via drill 0.3)
  Top 0.254: R4.1 9.09,42.09 v9.07,42.06 | v30.96,21.11 39.73,21.11 40.62,20.22 41.98,20.22 CPLD.4
  Route15 0.152: v9.07,42.06 9.07,41.3 10.79,39.57 10.79,33.12 10.79,31.83 11.71,30.94 12.72,30.94 14.78,28.85 14.78,27.48 17.12,25.17 24.49,25.17 25.53,25.17 25.68,25.17 28.78,22.1 29.97,22.1 v30.96,21.11
LED5  (via drill 0.3)
  Top 0.254: R5.1 11.25,42.11 v11.28,42.09 | v29.18,22.78 30.53,22.78 31.73,21.59 40.06,21.59 40.41,21.23 41.94,21.23 CPLD.6
  Route15 0.152: v11.28,42.09 11.28,40.18 11.68,39.78 11.68,36.6 17.88,30.4 22.94,30.4 26.29,27.05 26.29,25.65 v29.18,22.78
LED6  (via drill 0.3)
  Top 0.254: R6.1 13.41,42.14 v13.34,42.06 | CPLD.7 40.72,21.74 40.39,22.07 32.46,22.07 32.11,22.07 v29.57,24.61
  Route15 0.152: v13.34,42.06 13.31,36.88 13.31,36.5 18.67,31.14 22.1,31.14 23.19,31.14 29.57,24.77 v29.57,24.61
LED7  (via drill 0.3)
  Top 0.254: v15.57,42.06 R7.1 | v33.07,22.91 40.26,22.91 40.95,22.23 41.91,22.23 CPLD.8
  Route15 0.152: v15.57,42.06 15.57,36.2 15.57,35.66 18.92,32.31 22.96,32.31 32.33,22.91 v33.07,22.91
LED8  (via drill 0.3)
  Top 0.254: v17.73,42.01 R8.1 | v31.55,24.74 32.56,23.67 37.26,23.67 40.16,23.67 41.1,22.73 41.89,22.73 CPLD.9
  Route15 0.152: v17.73,42.01 17.73,34.67 19.1,33.27 22.96,33.27 28.63,27.66 v31.55,24.74
M0
  Top 0.254: FPGA.43 68.4,27.2 70.71,29.52 70.71,33.33 66.55,37.49 38.12,37.49 35.12,34.49 CPLD.36
M1
  Top 0.254: FPGA.42 66.28,26.7 68.58,26.7 71.3,29.36 71.3,33.5 66.73,38.08 37.85,38.08 35.07,35.33 33.62,33.88 CPLD.39
M2
  Top 0.254: FPGA.39 66.31,25.2 69.42,25.2 72.97,28.73 72.97,34.16 67.39,39.75 37.11,39.75 33.62,36.27 32.12,34.77 CPLD.42
MCLK
  Top 0.254: FPGA.83 50.48,27.18 47.8,27.18 46.69,27.18 44.63,29.23 42.88,29.23 CPLD.22 41.95,29.23 40.84,29.23 | 50MHZ.3 24.89,15.11 25.96,16.18 25.96,16.99
  Top 0.406: 25.96,16.99 27.76,18.82 27.76,24.38 32.61,29.23 40.79,29.23 40.84,29.23
MOSI  (via drill 0.3, 0.3 pad 0.41)
  Top 0.254: CPLD.90 35.12,15.45 37.62,12.9 63.83,12.9 68.12,17.2 68.12,18.72 67.64,19.2 FPGA.27 | SPI_FLASH.5 71.06,46.54 v70.03,47.57 | FPGA.27 66.23,19.18 | v64.85,19.2 FPGA.27
  Route15 0.152: v64.85,19.2 64.14,19.89 64.14,27.51 65.41,28.78 65.41,32.51 66.42,33.53 75.23,33.53 77.93,36.22 77.93,41.71 71.65,47.98 70.43,47.98 v70.03,47.57
N$2
  Top 0.254: VOLTAGE_REG.1 7.38,16.98 8.51,18.11 R23.2
  Top 0.406: R22.1 6.74,19.75 R23.2
  Top 0.813: 6.74,19.75 R22.1
N$3  (via drill 0.3)
  Top 0.254: VOLTAGE_REG.2 6.88,17.83 v7.09,18.03
  Top 0.813: v9.37,18.06 10.66,18.06 R24.1 10.68,19.74 R25.2
  Route2 0.254: v7.09,18.03 9.35,18.03 v9.37,18.06
N$4
  Top 0.254: VOLTAGE_REG.11 6.88,12.81 8,11.68 8,10.22 R18.1
  Top 0.406: R18.1 8.02,8.45 R19.2
N$5
  Top 0.254: J1.1 10.24,30.61 | 10.24,30.61 | 10.24,30.61 10.26,30.61 10.39,30.73
  pour Top (isolate 0.254): 1.32,37.19 12.14,37.19 12.17,34.87 10.69,34.87 10.69,30.45 10.03,30.45 10.03,34.92 1.32,34.92
N$6
  Top 0.254: VOLTAGE_REG.10 6.38,10.24 R20.1
  Top 0.406: 6.38,10.24 6.38,8.45 R21.2
N$7
  Top 0.254: VOLTAGE_REG.13 8.95,14.24 L1.P$1
N$13
  Top 0.254: VOLTAGE_REG.8 3.23,14.24 L4.P$1
N$16  (via drill 0.3)
  Top 0.254: VOLTAGE_REG.5 5.23,16.03 v4.52,16.74
  Top 0.61: v14.61,16.79 L2.P$2
  Route2 0.254: v4.52,16.74 6.73,16.74 7.44,16.03 13.84,16.03 v14.61,16.79
N$17
  Top 0.254: VOLTAGE_REG.4 5.88,16.95 3.76,19.07 2.26,19.07 L3.P$2
N$76
  Top 0.254: R30.1 33.58,48.41 34.49,47.5 34.49,45.97 34.95,45.52 36.6,45.52 I2C.5
N$183
  Top 0.254: C4.1 15.37,36.86 15.77,36.45 16.08,36.14 16.08,32.31 15.29,31.52 FT245RL.17
N$196
  Top 0.254: R1.2 LED1.C
N$197
  Top 0.254: R2.2 LED2.C
N$198
  Top 0.254: R3.2 LED3.C
N$199
  Top 0.254: R4.2 LED4.C
N$200
  Top 0.254: R5.2 LED5.C
N$201
  Top 0.254: R6.2 LED6.C
N$202
  Top 0.254: R7.2 LED7.C
N$203
  Top 0.254: R8.2 LED8.C
PROG_B
  Top 0.254: CPLD.99 39.62,15.52 40.01,15.14 51.79,15.14 52.38,15.72 52.38,16.82 FPGA.1
PWREN  (via drill 0.3)
  Top 0.254: FT245RL.12 18.54,31.52 R17.1 18.58,35.38 v20.52,35.38 | CPLD.43 v31.62,35.38
  Route15 0.152: v20.52,35.38 v31.62,35.38
RD
  Top 0.254: FT245RL.13 24.75,32.17 26.05,33.48 27.81,33.48 28.12,33.17 28.12,32.62 CPLD.50
RST  (via drill 0.3)
  Top 0.254: FT245RL.19 15.24,30.23 v15.93,30.91 | v44.04,25.83 43.45,25.24 CPLD.14
  Route2 0.254: v15.93,30.91 19.51,30.91 v22.71,34.11
  Route15 0.152: v22.71,34.11 32.26,34.11 41.12,25.25 43.46,25.25 v44.04,25.83
RX
  Top 0.254: FT245RL.23 14.89,27.62 15.67,26.85 15.67,24.89 17.73,22.84 24.74,22.84 25.32,22.25 CPLD.68
SW1  (via drill 0.3, 0.3 pad 0.41)
  Top 0.254: v24.33,19.41 24.5,19.24 CPLD.74 | SW1.1 R9.1 25.88,11.07 v24.33,12.62
  Route15 0.254: v24.33,12.62 v24.33,19.41
SW2  (via drill 0.3, 0.3 pad 0.41)
  Top 0.254: v23.14,19.68 23.69,20.24 CPLD.72 | SW2.1 19.69,11.06 R10.1 19.67,12.51 20.22,13.06 22.45,13.06 v23.14,13.74
  Route15 0.254: v23.14,13.74 v23.14,19.68
SW3  (via drill 0.3, 0.3 pad 0.41)
  Top 0.254: v23.11,20.75 26.24,20.75 CPLD.71 | SW3.1 12.4,11.06 R11.1 12.38,12.26 12.7,12.57 18.16,12.57 v18.85,13.26
  Route15 0.254: v18.85,13.26 18.85,16.48 v23.11,20.75
TCK
  Top 0.254: FPGA.77 45.92,30.2 44.88,31.22 41.33,31.22 40.46,30.35 30.1,30.35 29.12,31.3 29.12,31.71 CPLD.48 29.13,32.62 29.13,33.81 26.09,36.88 26.06,36.88 J7.3
TDI
  Top 0.254: CPLD.45 30.63,32.66 30.63,35.87 31.17,36.4 31.14,36.4 J7.5
TDO  (via drill 0.3)
  Top 0.254: v46,31.67 46.97,30.7 FPGA.76
  Route15 0.152: v46,31.67 35.79,41.88 29.39,41.88 28.63,41.12 28.6,41.12 J7.4
TMS
  Top 0.254: 52.4,32.59 FPGA.75 52.38,32.99 51.77,33.6 42.09,33.6 41.53,33.05 41.53,32.18 40.21,30.86 30.68,30.86 29.64,31.9 29.64,32.6 CPLD.47 29.64,32.63 29.64,36.55 29.87,36.75 29.87,40.56 30.58,41.27 33.02,41.27 33.71,40.59 33.68,40.59 J7.6
TX
  Top 0.254: FT245RL.22 15.21,28.27 16.15,27.33 16.15,25.17 17.98,23.34 25.02,23.34 25.63,22.73 CPLD.67
USBDM
  Top 0.254: J1.2 10.88,29.81 11.38,30.3 11.38,33.6 12.01,34.24 15.06,34.24 15.57,33.71 15.57,32.56 15.21,32.21 13.9,32.21 FT245RL.16
USBDP
  Top 0.254: J1.3 11.04,29.01 12.01,29.98 12.01,32.4 12.01,33.12 12.62,33.73 14.71,33.73 15.06,33.4 15.06,33.02 14.86,32.84 13.89,32.84 FT245RL.15 13.85,32.84
VCC  (via drill 0.3)
  Top 0.254: 51.69,3.99 J4.P$40 | 7.38,13.44 VOLTAGE_REG.12 8.18,13.59 v8.18,12.85 | VOLTAGE_REG.9 5.88,13.44 5.13,13.44 v5.13,12.85 | VOLTAGE_REG.3 6.38,17.6 v5.74,18.47 | 1.71,14.74 VOLTAGE_REG.7 | v1.7,14.1 1.71,14.74 | 1.71,14.74 1.71,15.51 C11.2 | VOLTAGE_REG.15 8.4,15.61 | 8.4,15.61 8.53,15.74 v8.53,16.97 | VOLTAGE_REG.16 8.16,15.61 8.4,15.61
  Top 0.406: 51.69,3.99 48.39,3.99 48.39,4.55 v46.99,4.55
  Top 0.813: C3.1 C2.1 5.35,37.88 FB.2 | FB.2 | v3.17,40.34 FB.2 | VOLTAGE_REG.16 9.13,15.74 9.37,15.98 C10.1
  Route2 0.406: v46.99,4.55 46.99,1.25 1.29,1.25 1.29,12.85 v5.13,12.85 | v5.74,18.47 1.57,18.47 1.27,18.77 1.27,38.43 v3.17,40.34
  Bottom 0.254: 51.69,3.96 J4.P$40
  Bottom 0.406: v46.99,4.55 48.39,4.55 48.39,3.96 51.69,3.96
  pour Route2: 1.32,19.15 10.21,19.15 10.21,11.25 1.27,11.25 1.27,19.18
VCCAUX  (via drill 0.3, 0.3 pad 0.41)
  Top 0.254: FPGA.74 52.91,32.55 v52.91,31.34 | FPGA.96 51.69,20.7 v51.74,20.75 | CPLD.5 43.12,20.74 v43.13,20.73 | FPGA.21 62.38,17.93 62.89,18.44 v62.89,21.23 | v64.19,29.11 64.19,28.7 FPGA.46 67.23,28.7 v67.26,28.5
  Top 0.813: L2.P$1 14.61,18.29 | 14.61,19.66 L2.P$1 | v14.61,21.23 14.61,19.66 | C9.1 13.26,19.66 14.61,19.66 | R24.2 14.61,18.03 L2.P$1
  Bottom 0.254: v67.26,28.5 C19.1
  Bottom 0.406: C12.1 52.91,35.41 v52.91,31.34 | C15.1 63.98,22.33 v62.89,21.23
  Bottom 0.61: v14.61,21.23 14.63,21.26 14.63,23.5 1.42,23.47 1.42,38.02 21.01,38.02 20.98,38.02 J7.1
  pour Route2 (isolate 0.305): 14.33,20.7 14.33,22.12 52.04,22.12 52.04,31.52 53.64,31.52 53.64,29.13 65.3,29.13 65.3,28.17 63.2,28.17 63.17,20.73 61.57,20.73 61.59,20.7
VCCINT  (via drill 0.3, 0.3 pad 0.41)
  Top 0.254: FPGA.56 61.88,33.06 v61.37,33.53 | FPGA.6 54.88,16.1 v54.53,15.75 | FPGA.28 65.59,19.7 v65.13,20.17 | FPGA.80 47.37,28.7 v46.74,29.34
  Top 0.813: C6.1 9.73,10.2 R18.2 9.71,11.44 L1.P$2 v14.53,13.66
  Bottom 0.406: v61.37,33.53 C17.1 | C21.1 65.63,19.66 v65.13,20.17
  pour Route2 (isolate 0.305, rank 2): 10.9,16.71 10.92,10.16 73.38,10.16 73.38,37.82 45.06,37.82 45.06,28.83 50.7,28.83 50.7,32.99 64.31,32.99 64.31,16.64
VCCO  (via drill 0.3, 0.3 pad 0.41)
  Top 0.254: v38.73,15.72 39.12,16.11 CPLD.98 39.12,17.36 39.34,17.58 43.46,17.58 49.48,17.58 | CPLD.38 34.12,33.34 v34.44,33.71 | CPLD.51 v26.25,31.66 v26.24,31.67 | FPGA.82 51.36,27.7 v52.2,27.71 | CPLD.88 34.14,16.86 v34.14,18.03 | FPGA.55 62.38,31.32 v62.36,31.29 62.36,28.2 FPGA.45 | FPGA.73 53.38,31.91 53.7,31.6 53.7,30.81 53.39,30.5 52.68,30.5 v51.71,30.5 | FPGA.8 55.88,18.74 v55.85,18.95 | FPGA.31 64.18,21.2 63.8,20.83 63.8,19.28 v63.75,19.23 | 49.48,17.58 v49.86,17.91 49.48,17.58 | FPGA.97 49.14,20.2 v49.28,20.37 | FPGA.20 61.88,18.93 v62.18,19.23 62.18,19.2 | R26.2 29.76,43.92 v31.73,43.92 | I2C.8 36.62,48.82 v36.65,49.58 | R27.2 20.37,49.26 v20.37,48.82 19.83,48.82 C25.1 | v19.38,19.51 19.38,20.21 50MHZ.4 21.17,18.15 C5.2 | FT245RL.4 19.56,26.34 | 15.52,29.57 FT245RL.20 | R29.2 42.18,43.96 v42.98,43.16 | R11.2 14.08,8.22 v14.07,2.72 | R10.2 21.37,7.76 v21.39,2.74 | R9.2 28.69,7.76 v28.7,4.45 | SPI_FLASH.8 67.72,44.45 v67.72,45.03
  Top 0.813: 19.56,26.34 19.56,29.57 17.25,29.57 16.94,29.57 | 15.52,29.57 16.94,29.57 | R17.2 v17.08,36.79 v17.07,36.78 17.07,29.69 16.94,29.57 | v3.23,10.24 R20.2 | C7.1 v3.23,10.24 | v3.23,10.24 L4.P$2
  Route2 0.813: v52.2,27.71 50.06,27.71 50.06,27.69
  Bottom 0.406: C24.+ 51.71,35.48 v51.71,30.5 | C18.1 65.09,31.29 v62.36,31.29 | C14.1 60.47,19.23 v62.18,19.23 | C13.1 58,18.95 v55.85,18.95 | C22.1 47.26,17.91 v49.86,17.91 | C23.1 47.59,20.37 v49.28,20.37
  other vias: 19.15,48.82
  pour Top (isolate 0.254): 1.22,50.06 20.83,50.06 20.83,48.16 1.22,48.16
  pour Route2 (isolate 0.305, rank 3): 1.22,1.17 79.88,1.17 79.88,50.06 1.22,50.06
  pour Top (isolate 0.127, rank 4): 42.4,46.84 42.4,50.12 24.55,50.12 24.52,46.84
VS0
  Top 0.254: CPLD.30 38.12,34.16 39.19,35.23 65.86,35.23 68.38,32.72 68.38,31.01 67.54,30.2 66.23,30.2 FPGA.49
VS1
  Top 0.254: FPGA.48 66.27,29.69 67.97,29.69 68.94,30.61 68.94,32.89 66.02,35.81 38.63,35.81 36.62,33.81 CPLD.33
VS2
  Top 0.254: FPGA.47 66.27,29.18 68.3,29.18 69.52,30.38 69.52,33.05 66.19,36.37 38.53,36.37 36.12,33.97 CPLD.34
W  (via drill 0.3)
  Top 0.254: v35.03,8.94 42.34,1.65 70.1,1.65 74.12,5.64 77.22,8.76 77.24,38.56 75.57,40.25 SPI_FLASH.3 | v38.02,18.59 38.61,18.01 38.61,16.79
  Route15 0.152: v35.03,8.94 35.03,15.62 v38.02,18.59
WR
  Top 0.254: FT245RL.14 24.44,32.83 25.76,34.14 27.91,34.14 28.63,33.43 CPLD.49

## Text on the board
Bottom: cy@montana.net | E. R. L.L.C. | 6/09
_tNames: C27 | R30 | R28 | I2C | C28 | R1 | R2 | R3 | R4 | R5 | R6 | R7 | R8 | C25 | R27 | C26 | R29 | J2 | C29 | R26 | C1 | C4 | FB | R17 | C2 | C3 | J1 | CPLD | FT245RL | FPGA | C8 | C9 | R23 | R25 | 25MHZ | R22 | R9 | R24 | C11 | C10 | C5 | R18 | R20 | R21 | R19 | C7 | C6
_bNames: C20 | C16 | C17 | C24 | C12 | C18 | C19 | C15 | C23 | C13 | C14 | C21 | C22
_tValues: VREF | GND | TCK | TDO | TDI | TMS